# Altium schematic sheet POWER.SchDoc
size A4; SheetNumber: 1; SheetTotal: 4
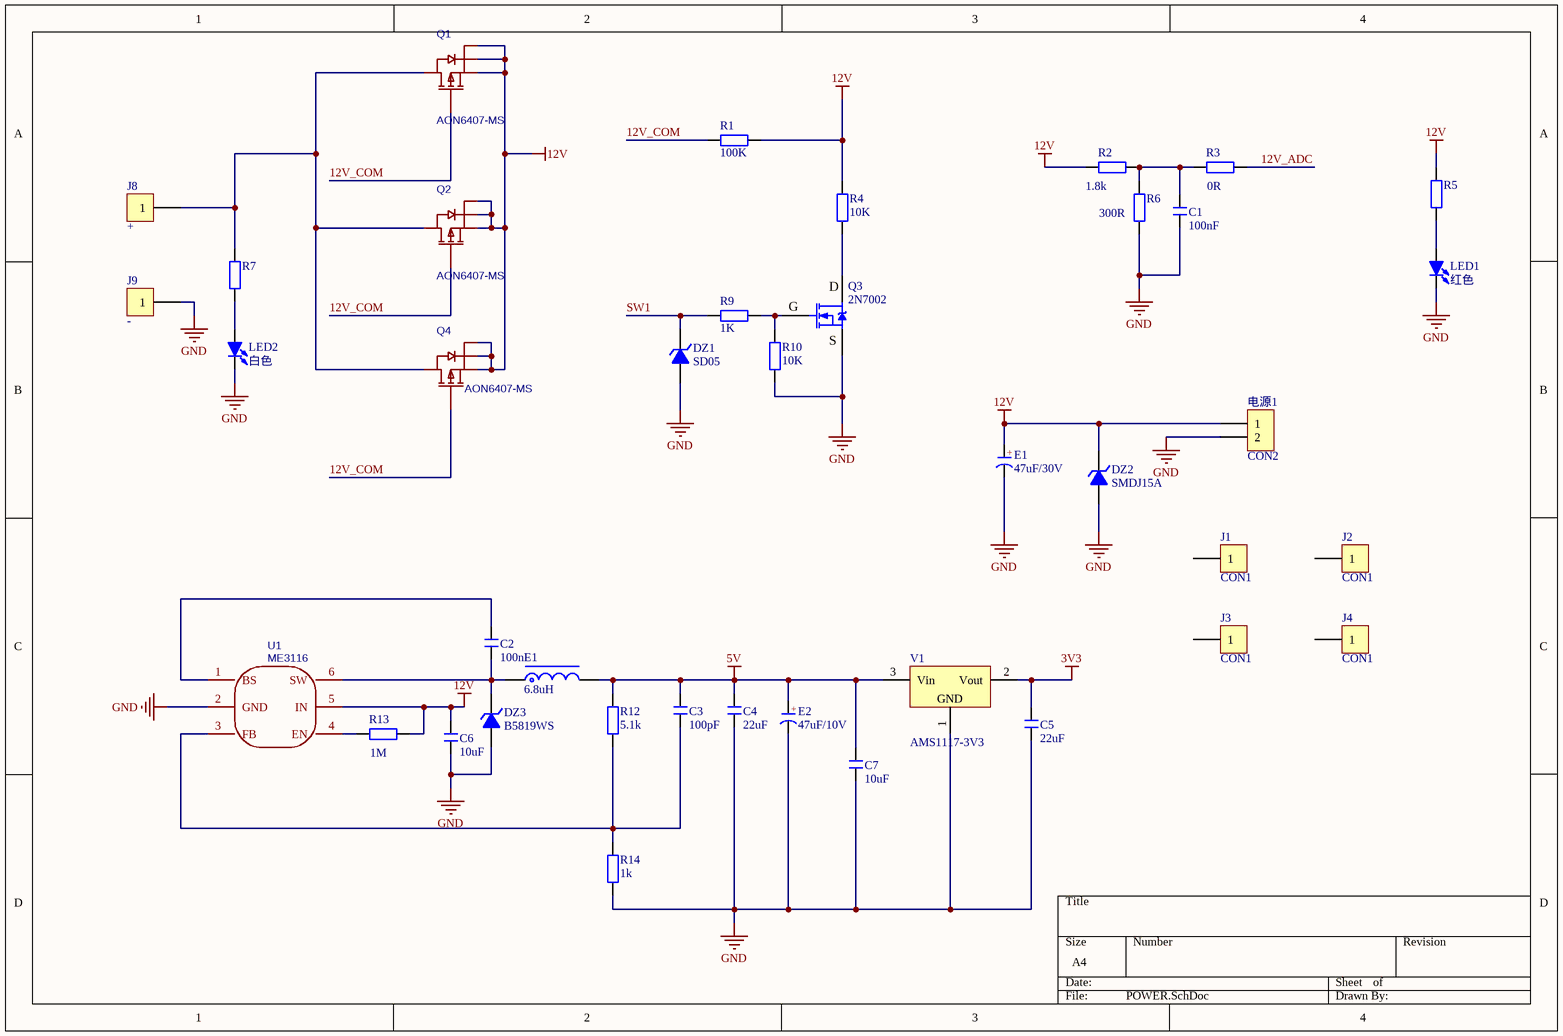
[diagram p0: POWER.SchDoc]

## Parts
C1  100nF  [C 0805_L]
C2  100nF  [C 0805_L]
C3  100pF  [C 0805_L]
C4  22uF  [C 0805_L]
C5  22uF  [C 0805_L]
C6  10uF  [C 0805_L]
C7  10uF  [C 0805_L]
DZ1  SD05  [SOD-323]
DZ2  SMDJ15A  [SMC]
DZ3  B5819WS  [SOD-323]
E1  47uF/30V  [CM D(6.3*7.7)]
E2  47uF/10V  [CM B(4*5.4)]
J1  CON1  [M3x5+6_L]
J2  CON1  [M3x5+6_L]
J3  CON1  [M3x5+6_L]
J4  CON1  [M3x5+6_L]
J8  +  [HDR2.54-LI-1P]
J9  -  [HDR2.54-LI-1P]
L1  6.8uH  [CD42]
LED1  红色  [LED 0805R]
LED2  白色  [LED 0805B]
Q1  AON6407-MS  [TDSON-8_L5.9-W5.2-P1.27-BL]
Q2  AON6407-MS  [TDSON-8_L5.9-W5.2-P1.27-BL]
Q3  2N7002  [SOT-23]
Q4  AON6407-MS  [TDSON-8_L5.9-W5.2-P1.27-BL]
R1  100K  [R 0805_L]
R2  1.8k  [R 0805_L]
R3  0R  [R 0805_L]
R4  10K  [R 0805_L]
R5  (no value)  [R 0805_L]
R6  300R  [R 0805_L]
R7  (no value)  [R 0805_L]
R9  1K  [R 0805_L]
R10  10K  [R 0805_L]
R12  5.1k  [R 0805_L]
R13  1M  [R 0805_L]
R14  1k  [R 0805_L]
U1  ME3116  [SOT23-6]
V1  AMS1117-3V3  [SOT-223]
电源1  CON2  [TX60PW-M20]

## Nets
3V3: C5.2 V1.2(Vout)
5V: C3.2 C4.2 C7.2 E2.1(A) L1.2 R12.2 V1.3(Vin)
12V: C6.2 DZ2.2(K) E1.1(A) Q1.1(S) Q1.2(S) Q1.3(S) Q2.1(S) Q2.2(S) Q2.3(S) Q4.1(S) Q4.2(S) Q4.3(S) R1.1 R2.2 R4.2 R5.1 R13.1 U1.5(IN) 电源1.1
GND: C1.1 C4.1 C5.1 C6.1 C7.1 DZ1.1(A) DZ2.1(A) DZ3.1(A) E1.2(K) E2.2(K) J9.1 LED1.2(K) LED2.2(K) Q3.3(S) R6.2 R10.1 R14.1 U1.2(GND) V1.1(GND) 电源1.2
12V_ADC: R3.2
12V_COM: Q1.4(G) Q2.4(G) Q4.4(G) R1.2
SW1: DZ1.2(K) R9.1
NetC1_2: C1.2 R2.1 R3.1 R6.1
NetC2_1: C2.1 DZ3.2(K) L1.1 U1.6(SW)
NetC2_2: C2.2 U1.1(BS)
NetC3_1: C3.1 R12.1 R14.2 U1.3(FB)
NetJ8_1: J8.1 Q1.5(D) Q2.5(D) Q4.5(D) R7.1
NetLED1_1: LED1.1(A) R5.2
NetLED2_1: LED2.1(A) R7.2
NetQ3_1: Q3.1(G) R9.2 R10.2
NetQ3_2: Q3.2(D) R4.1
NetR13_2: R13.2 U1.4(EN)

Not connected (* = marked no-connect by the designer): J1 1; J2 1; J3 1; J4 1

## Notes on the sheet
- (in symbol C-CS) +

## Library data of the parts
C1-C7 = C: 无极性贴片电容; 版权归属: 源创客; BOM名称: 无极性贴片电容; 学习资源: www.ooocke.com
DZ1 = 1N4106: 单向TVS 5V截止 峰值脉冲电流：17A              C502527; BOM名称: 12V/0.5W稳压管; 版权归属: 源创客; 学习资源: www.ooocke.com
DZ2 = 1N4106: TVS 15V截止 峰值浪涌电流：123A                   C438153; BOM名称: 12V/0.5W稳压管; 版权归属: 源创客; 学习资源: www.ooocke.com
DZ3 = 1N5256: 电压:40V 电流:1A                                C7420331; BOM名称: 30V/0.5W稳压管; 版权归属: 源创客; 学习资源: www.ooocke.com
E1 = C-CS: JVJ50V47M6x8                        47uF ±20% 50V                            C46550421; BOM名称: 直插固态电容; 版权归属: 源创客; 学习资源: www.ooocke.com
E2 = C-CS: 47uF ±20% 10V                           C48970978; BOM名称: 直插固态电容; 版权归属: 源创客; 学习资源: www.ooocke.com
J8 J9 = CON1
L1 = L-CD: YP0402-6R8M                          C576569; BOM名称: 功率电感; 版权归属: 源创客; 学习资源: www.ooocke.com
LED1 LED2 = LED-SMD: 贴片LED; 版权归属: 源创客; BOM名称: 贴片LED; 学习资源: www.ooocke.com
Q1 Q2 Q4 = AON6407-MS: Manufacturer: MSKSEMI(美森科); Contributor: lcsc; Supplier: LCSC; Supplier Part: C17702953; Manufacturer Part: AON6407-MS; JLCPCB Part Class: Extended Part; spicePre: Q; spiceSymbolName: AON6407-MS
Q3 = IRF840: N沟场效应管; pin to pad: 2>3 3>2; 版权归属: 源创客; BOM名称: N沟场效应管; 学习资源: www.ooocke.com
R1-R7 R9 R10 R12-R14 = R: 贴片电阻; 版权归属: 源创客; BOM名称: 贴片电阻; 学习资源: www.ooocke.com
U1 = ME3116: ME3116AM6G / ME3116是一款内部集成了MOSFET的异步整流降压型稳压器,能够在4.75V至40V的输入电压范围内提供高达1A的负载能力。采用PWM控制模式,具有良好的瞬态响应和逐周期限流功能。在轻载条件下自动切换到PFM模式,保证较高的轻载效率。内置软启动和环路补偿,具有过热关断、输入欠压保护、BS欠压保护和短路保护。; Manufacturer: MICRONE(南京微盟); Supplier: LCSC; Manufacturer Part: ME3116AM6G; Supplier Part: C97643; JLCPCB Part Class: Extended Part; spicePre: U; spiceSymbolName: ME3116
V1 = AMS1117: 三端稳压芯片; BOM名称: 稳压芯片; 版权归属: 源创客; 学习资源: www.ooocke.com
电源1 = CON2: Connector